# Altium schematic sheet Mixer.SchDoc
size A4; Organization: Altium Limited; Address1: L3, 12a Rodborough Rd; Address2: Frenchs Forest; Address3: NSW; Address4: Australia 2086; DocumentNumber: 5; SheetNumber: 5; SheetTotal: 8
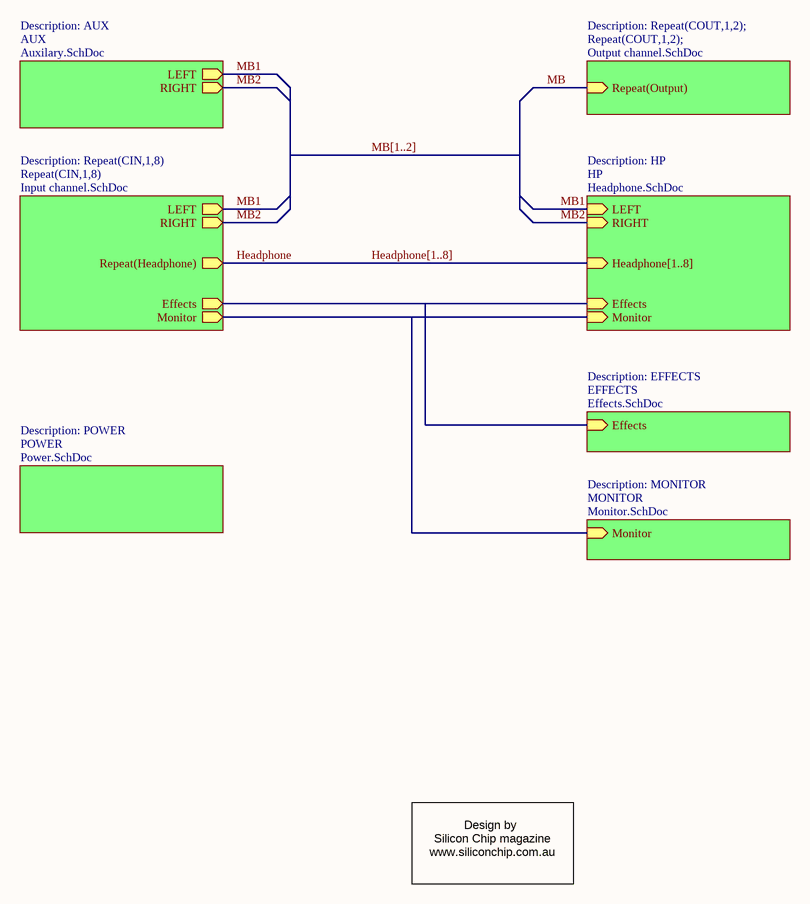
[diagram p0: Mixer.SchDoc]

## Sub-sheets
AUX = Auxilary.SchDoc: LEFT, RIGHT  | Description: AUX
EFFECTS = Effects.SchDoc: Effects  | Description: EFFECTS
HP = Headphone.SchDoc: Headphone[1..8] (in), Monitor, Effects, LEFT, RIGHT  | Description: HP
MONITOR = Monitor.SchDoc: Monitor  | Description: MONITOR
POWER = Power.SchDoc: no entries  | Description: POWER
Repeat(CIN,1,8) = Input channel.SchDoc: Monitor, LEFT, Repeat(Headphone) (out), Effects, RIGHT  | Description: Repeat(CIN,1,8)
Repeat(COUT,1,2); = Output channel.SchDoc: Repeat(Output)  | Description: Repeat(COUT,1,2);

## Nets
Headphone: sheet Repeat(CIN,1,8)/Repeat(Headphone)
MB: sheet Repeat(COUT,1,2);/Repeat(Output)
MB1: sheet AUX/LEFT, sheet Repeat(CIN,1,8)/LEFT, sheet HP/LEFT
MB2: sheet AUX/RIGHT, sheet Repeat(CIN,1,8)/RIGHT, sheet HP/RIGHT
(unnamed): sheet Repeat(CIN,1,8)/Monitor, sheet MONITOR/Monitor, sheet HP/Monitor
(unnamed): sheet Repeat(CIN,1,8)/Effects, sheet EFFECTS/Effects, sheet HP/Effects

## Buses and harness runs
bus Headphone[1..8] = sheet HP/Headphone[1..8]
bus MB[1..2]

## Notes on the sheet
- Design by
  Silicon Chip magazine
  www.siliconchip.com.au
- Title
- Size:
- Date:
- A4
- Number:
- Time:
- Revision:
- Sheet
- of
- File: